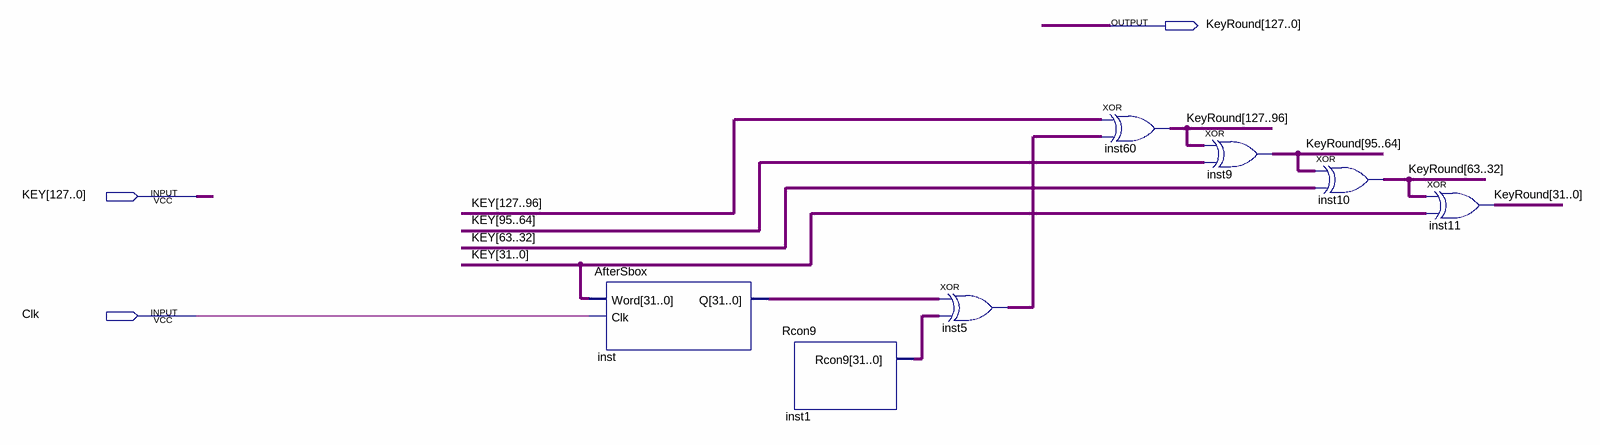
[diagram p0: schematic sheet]
// Quartus schematic KeyExpansions9.bdf as structural Verilog: 7 symbols, 3 pins
module KeyExpansions9 (
  input  [127:0] KEY,
  input  Clk,
  output [127:0] KeyRound
);

  wire [31:0] inst1_rcon9, inst5_out, inst_q;

  AfterSbox inst (.Word(KEY[31:0]), .Clk(Clk), .Q(inst_q));
  Rcon9 inst1 (.Rcon9(inst1_rcon9));
  assign inst5_out = inst_q ^ inst1_rcon9;  // XOR inst5, 32 bits wide
  assign KeyRound[127:96] = KEY[127:96] ^ inst5_out;  // XOR inst60, 32 bits wide
  assign KeyRound[95:64] = KeyRound[127:96] ^ KEY[95:64];  // XOR inst9, 32 bits wide
  assign KeyRound[63:32] = KeyRound[95:64] ^ KEY[63:32];  // XOR inst10, 32 bits wide
  assign KeyRound[31:0] = KeyRound[63:32] ^ KEY[31:0];  // XOR inst11, 32 bits wide
endmodule
